# Altium schematic sheet MIDI.SchDoc
size A4; SheetNumber: 10; SheetTotal: 11
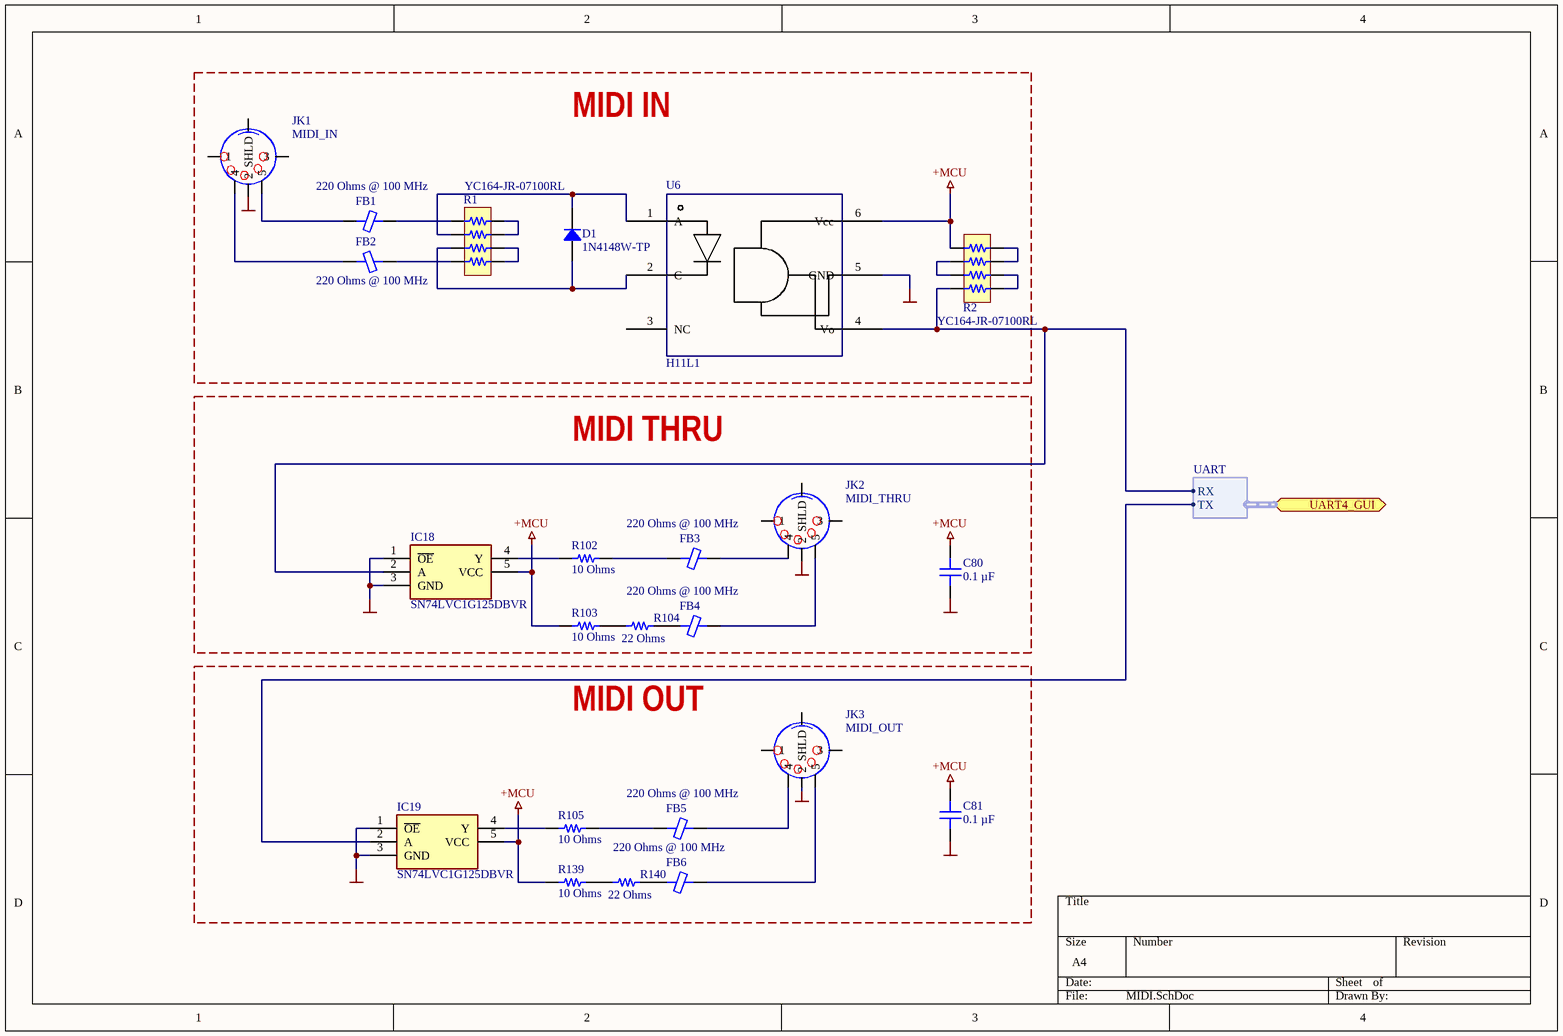
[diagram p0: MIDI.SchDoc]

## Parts
C80  0.1 µF  [CAP 0603_1608]
C81  0.1 µF  [CAP 0603_1608]
D1  1N4148W-TP  [SOD-123]
FB1  220 Ohms @ 100 MHz  [FER 0805_2012]
FB2  220 Ohms @ 100 MHz  [FER 0805_2012]
FB3  220 Ohms @ 100 MHz  [FER 0805_2012]
FB4  220 Ohms @ 100 MHz  [FER 0805_2012]
FB5  220 Ohms @ 100 MHz  [FER 0805_2012]
FB6  220 Ohms @ 100 MHz  [FER 0805_2012]
IC18  SN74LVC1G125DBVR  [SOT95P280X145-5N]
IC19  SN74LVC1G125DBVR  [SOT95P280X145-5N]
JK1  MIDI_IN  [DIN5]
JK2  MIDI_THRU  [DIN5]
JK3  MIDI_OUT  [DIN5]
R1  YC164-JR-07100RL  [RESNET 1206-8 CONVEX]
R2  YC164-JR-07100RL  [RESNET 1206-8 CONVEX]
R102  10 Ohms  [RES 0603_1608]
R103  10 Ohms  [RES 0603_1608]
R104  22 Ohms  [RES 0402_1005]
R105  10 Ohms  [RES 0603_1608]
R139  10 Ohms  [RES 0603_1608]
R140  22 Ohms  [RES 0402_1005]
U6  H11L1  [SOIC254 DIP-6]

## Blocks framed on the sheet
MIDI IN: D1 FB1 FB2 JK1 R1 R2 U6
MIDI THRU: C80 FB3 FB4 IC18 JK2 R102-R104
MIDI OUT: C81 FB5 FB6 IC19 JK3 R105 R139 R140

## Ports
UART4_GUI (bidir, harness UART)

## Harnesses
UART: RX, TX

## Nets
+MCU: C80.1 C81.1 IC18.5(VCC) IC19.5(VCC) R2.1 R103.1 R139.1 U6.6(Vcc)
GND: C80.2 C81.2 IC18.1(~{OE}) IC18.3(GND) IC19.1(~{OE}) IC19.3(GND) JK1.2 JK2.2 JK3.2 U6.5(GND)
NetD1_1: D1.1 R1.7 U6.2(C)
NetD1_2: D1.2 R1.6 U6.1(A)
NetFB1_1: FB1.1 JK1.5
NetFB1_2: FB1.2 R1.5
NetFB2_1: FB2.1 JK1.4
NetFB2_2: FB2.2 R1.8
NetFB3_1: FB3.1 R102.2
NetFB3_2: FB3.2 JK2.4
NetFB4_1: FB4.1 R104.2
NetFB4_2: FB4.2 JK2.5
NetFB5_1: FB5.1 R105.2
NetFB5_2: FB5.2 JK3.4
NetFB6_1: FB6.1 R140.2
NetFB6_2: FB6.2 JK3.5
NetIC18_2: IC18.2(A) R2.4 U6.4(Vo) ; port UART4_GUI.RX
NetIC18_4: IC18.4(Y) R102.1
NetIC19_2: IC19.2(A) ; port UART4_GUI.TX
NetIC19_4: IC19.4(Y) R105.1
NetR1_1: R1.1 R1.2
NetR1_3: R1.3 R1.4
NetR2_2: R2.2 R2.3
NetR2_5: R2.5 R2.6
NetR2_7: R2.7 R2.8
NetR103_2: R103.2 R104.1
NetR139_2: R139.2 R140.1

Not connected (* = marked no-connect by the designer): JK1 1 3 6(SHLD); JK2 1 3 6(SHLD); JK3 1 3 6(SHLD); U6 3(NC)

## Library data of the parts
C80 C81 = C0603C104K5RAC7411: CAP CER 0.1UF 50V X7R 0603; manufacturer: KEMET; Tolerance: ±10%; Part Number: C0603C104K5RAC7411; Value: 0.1 µF; Applications: Bypass, Decoupling; Capacitance: 0.1 µF; componentlink1description: Datasheet; componentlink1url: https://api.kemet.com/component-edge/download/datasheet/C0603C104K5RAC7411.pdf; componentlink2description: DigiKey Link; componentlink2url: https://www.digikey.com/en/products/detail/kemet/C0603C104K5RAC7411/3317013; Device Package: 0603 (1608 Metric); lastupdated: 2/9/2024 8:10:30 PM; Lifecycle Status: Active; Minimum Order: 1; Mounting Type: Surface Mount, MLCC; Operating Temperature: -55°C ~ 125°C; Package / Case: 0603 (1608 Metric); packaging: TapeAndReel; partid: 2233; Part Status: Active; price: 0.01; series: SMD Comm X7R; Size / Dimension: 0.063" L x 0.031" W (1.60mm x 0.80mm); Supplier 1: DigiKey; Supplier Part Number 1: 399-C0603C104K5RAC7411CT-ND; Temperature Coefficient: X7R; Thickness (Max): 0.035" (0.90mm); Voltage - Rated: 50V
D1 = 1N4148W-TP: DIODE GEN PURP 100V 150MA SOD123; Manufacturer: Micro Commercial Co; Capacitance @ Vr, F: 2pF @ 0V, 1MHz; Current - Reverse Leakage @ Vr: 1 µA @ 75 V; Diode Type: Standard; Reverse Recovery Time (trr): 4 ns; Speed: Small Signal =< 200mA (Io), Any Speed; Voltage - Forward (Vf) (Max) @ If: 1.25 V @ 150 mA; Part Number: 1N4148W-TP; ComponentLink1Description: Datasheet; ComponentLink1URL: https://www.mccsemi.com/pdf/Products/1N4148W(SOD123).pdf; ComponentLink2Description: DigiKey Link; ComponentLink2URL: https://www.digikey.com/en/products/detail/micro-commercial-co/1N4148W-TP/717196; Current - Average Rectified (Io): 150mA; LastUpdated: 6/3/2024 7:54:46 PM; Lifecycle Status: Active; Minimum Order: 1; Mounting Type: Surface Mount; Operating Temperature - Junction: -65°C ~ 150°C; Package / Case: SOD-123; Packaging: TapeAndReel; PartId: 999; Part Status: Active; Price: 0.01; Series: -; Supplier 1: DigiKey; Supplier Part Number 1: 1N4148WTPMSCT-ND; Supplier Device Package: SOD-123; Voltage - DC Reverse (Vr) (Max): 100 V
FB1-FB6 = BLM21PG221SN1D: FERRITE BEAD 220 OHM 0805 1LN; Manufacturer: Murata Electronics; Current Rating (Max): 2A; DC Resistance (DCR) (Max): 45mOhm; Filter Type: Power Line; Number of Lines: 1; Part Number: BLM21PG221SN1D; ComponentLink1Description: Datasheet; ComponentLink1URL: https://www.murata.com/en-us/products/en-us/products/productdata/8796738977822/ENFA0005.pdf; ComponentLink2Description: DigiKey Link; ComponentLink2URL: https://www.digikey.com/en/products/detail/murata-electronics/BLM21PG221SN1D/364909; Device Package: 0805 (2012 Metric); Height (Max): 0.041" (1.05mm); Impedance @ Frequency: 220 Ohms @ 100 MHz; LastUpdated: 6/3/2024 7:52:22 PM; Lifecycle Status: Active; Minimum Order: 1; Mounting Type: Surface Mount; Operating Temperature: -55°C ~ 125°C; Package / Case: 0805 (2012 Metric); Packaging: TapeAndReel; PartId: 1360; Part Status: Active; Price: 0.02; Series: EMIFIL®, BLM21; Size / Dimension: 0.079" L x 0.049" W (2.00mm x 1.25mm); Supplier 1: DigiKey; Supplier Part Number 1: 490-1054-1-ND; Value: 220 Ohms @ 100 MHz
IC18 IC19 = SN74LVC1G125DBVR: Integrated Circuit; Manufacturer_Name: Texas Instruments; Datasheet Link: http://www.ti.com/lit/ds/symlink/sn74lvc1g125.pdf; Height: 1.45mm; Manufacturer_Part_Number: SN74LVC1G125DBVR; Mouser Part Number: 595-SN74LVC1G125DBVR; Mouser Price/Stock: https://www.mouser.co.uk/ProductDetail/Texas-Instruments/SN74LVC1G125DBVR?qs=dT9u2OTAaVWCjkJK89JQQg%3D%3D; Arrow Part Number: SN74LVC1G125DBVR; Arrow Price/Stock: https://www.arrow.com/en/products/sn74lvc1g125dbvr/texas-instruments?region=nac
JK1-JK3 = DIN5
R1 R2 = YC164-JR-07100RL: RES ARRAY 4 RES 100 OHM 1206; Manufacturer: Yageo; Circuit Type: Isolated; Number of Resistors: 4; Power Per Element: 62.5mW; Resistance (Ohms): 100; Temperature Coefficient: ±200ppm/°C; Tolerance: ±5%; Part Number: YC164-JR-07100RL; Applications: DDRAM, SDRAM; ComponentLink1Description: Datasheet; ComponentLink1URL: https://www.yageo.com/upload/media/product/productsearch/datasheet/rchip/PYu-YC_TC_group_51_RoHS_L_9.pdf; ComponentLink2Description: DigiKey Link; ComponentLink2URL: http://digikey.com/product-detail/en/yageo/YC164-JR-07100RL/YC164J-100CT-ND/1005656; Height - Seated (Max): 0.028" (0.70mm); LastUpdated: 9/2/2020 1:23:24 AM; Lifecycle Status: Active; Minimum Order: 1; Mounting Type: Surface Mount; Number of Pins: 8; Operating Temperature: -55°C ~ 155°C; Package / Case: 1206 (3216 Metric), Convex, Long Side Terminals; Packaging: TapeAndReel; PartId: 239; Part Status: Active; Price: 0.01; Series: YC164; Size / Dimension: 0.126" L x 0.063" W (3.20mm x 1.60mm); Supplier 1: DigiKey; Supplier Part Number 1: YC164J-100CT-ND
R102 R103 R105 R139 = ERJ-PA3F10R0V: RES SMD 10 OHM 1% 1/3W 0603; Manufacturer: Panasonic Electronic Components; Power (Watts): 0.333W, 1/3W; Temperature Coefficient: ±100ppm/°C; Part Number: ERJ-PA3F10R0V; Value: 10 Ohms; ComponentLink1Description: Datasheet; ComponentLink1URL: https://industrial.panasonic.com/cdbs/www-data/pdf/RDO0000/AOA0000C331.pdf; ComponentLink2Description: DigiKey Link; ComponentLink2URL: https://www.digikey.com/en/products/detail/panasonic-electronic-components/ERJ-PA3F10R0V/5035852; Composition: Thick Film; Device Package: 0603 (1608 Metric); Features: Automotive AEC-Q200, Pulse Withstanding; Height - Seated (Max): 0.022" (0.55mm); LastUpdated: 2/9/2024 8:43:35 PM; Lifecycle Status: Active; Minimum Order: 1; Number of Terminations: 2; Operating Temperature: -55°C ~ 155°C; Package / Case: 0603 (1608 Metric); Packaging: TapeAndReel; PartId: 5368; Part Status: Active; Price: 0.01; Ratings: AEC-Q200; Resistance: 10 Ohms; Series: ERJ-PA3; Size / Dimension: 0.063" L x 0.031" W (1.60mm x 0.80mm); Supplier 1: DigiKey; Supplier Part Number 1: P10.00BYCT-ND; Supplier Device Package: 0603; Tolerance: ±1%
R104 R140 = RMCF0402JT22R0: RES 22 OHM 5% 1/16W 0402; Manufacturer: Stackpole Electronics Inc; Power (Watts): 0.063W, 1/16W; Temperature Coefficient: ±100ppm/°C; Part Number: RMCF0402JT22R0; Value: 22 Ohms; ComponentLink1Description: Datasheet; ComponentLink1URL: https://www.seielect.com/catalog/sei-rmcf_rmcp.pdf; ComponentLink2Description: DigiKey Link; ComponentLink2URL: https://www.digikey.com/en/products/detail/stackpole-electronics-inc/RMCF0402JT22R0/1758165; Composition: Thick Film; Device Package: 0402 (1005 Metric); Features: Automotive AEC-Q200; Height - Seated (Max): 0.016" (0.40mm); LastUpdated: 2/9/2024 8:30:03 PM; Lifecycle Status: Active; Minimum Order: 1; Number of Terminations: 2; Operating Temperature: -55°C ~ 155°C; Package / Case: 0402 (1005 Metric); Packaging: CutTape; PartId: 7671; Part Status: Active; Price: 0.01; Resistance: 22 Ohms; Series: RMCF; Size / Dimension: 0.039" L x 0.020" W (1.00mm x 0.50mm); Supplier 1: DigiKey; Supplier Part Number 1: RMCF0402JT22R0CT-ND; Supplier Device Package: 0402; Tolerance: ±5%; Ratings: AEC-Q200
U6 = H11L1SR2M: OPTOISO 4.17KV OPN COLL 6SMD